# EasyEDA Pro project 小智扩展板.epro

# Board MP3语音模块
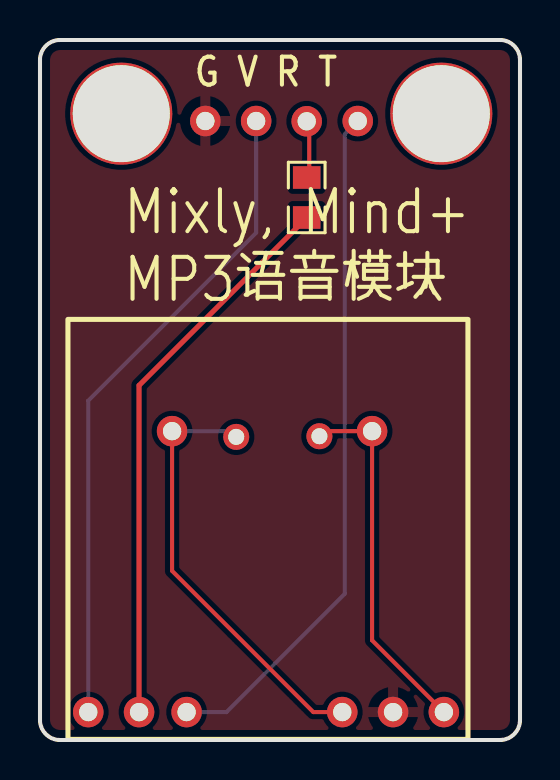
[diagram p0: board, top side]
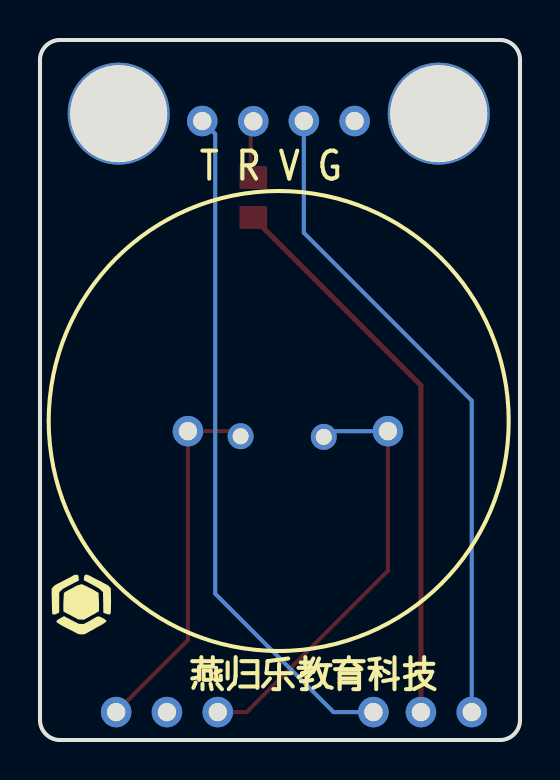
[diagram p1: board, bottom side, seen from below]

Outline 24 x 35 mm; copper layers: Top Layer, Bottom Layer. Coordinates in mm from the lower left corner of the outline.
Outline path: 0,34 0,1 arc(0.29,0.29) 1,0 23,0 arc(23.71,0.29) 24,1 24,34 arc(23.71,34.71) 23,35 1,35 arc(0.29,34.71) 0,34
Stack: Top Layer 0.0356mm / Dielectric1 0.32mm FR-4 er 4.8 / Bottom Layer 0.0356mm

## Design rules (mm)
template: 用户自定义配置
spacing Clearance (default): track to track 0.254, other pairs 0 to 0.254
track width Width (default): min 0.203, default 0.254, max 0.762
differential pair DiffPairsRouting (default): width min 0.381, default 0.381, max 0.381; gap min 0.254, default 0.254
via RoutingVias (default): diameter min 1.27, default 1.27, max 1.27; hole min 0.711, default 0.711, max 0.711

## Placement (name value [footprint] x y rotation side)
NOREF  -  [Pad_e131]  16.6 15.44 180 top
NOREF#2  -  [Pad_ie20]  15.11 1.4 0 top
NOREF#3  -  [Pad_ie118]  9.81 15.16 180 top
NOREF#4  -  [Pad_e315]  20.07 31.32 180 top
NOREF#5  -  [Pad_ie58]  10.81 30.95 180 top
NOREF#6  -  [Pad_ie83]  8.27 30.95 180 top
NOREF#7  -  [Pad_ie56]  13.34 30.94 180 top
NOREF#8  -  [Pad_e312]  4.06 31.32 180 top
NOREF#9  -  [Pad_e130]  6.6 15.44 180 top
NOREF#10  -  [Pad_ie12]  2.41 1.4 0 top
NOREF#11  -  [Pad_ie117]  13.97 15.19 180 top
NOREF#12  -  [Pad_ie15]  4.95 1.4 0 top
NOREF#13  -  [Pad_ie35]  15.89 30.95 180 top
NOREF#14  -  [Pad_ie25]  17.65 1.4 0 top
NOREF#15  -  [Pad_ie26]  20.19 1.4 0 top
NOREF#16  -  [Pad_ie2]  7.33 1.4 0 top
R1  1kΩ  [R0805]  13.34 27.13 90 top

## Footprints (pads in the part's own frame, mm; a bottom-side part is the same pattern mirrored in y, then rotated)
Pad_e130
  round 1.524 hole 0.914: 1(0,0)
Pad_e131
  round 1.524 hole 0.914: 2(0,0)
Pad_e312
  round 5.1 hole 4.85: 3(0,0)
Pad_e315
  round 5.1 hole 4.85: 3(0,0)
Pad_ie2
  round 1.524 hole 0.914: 12(0,0)
Pad_ie12
  round 1.524 hole 0.914: 12(0,0)
Pad_ie15
  round 1.524 hole 0.914: 12(0,0)
Pad_ie20
  round 1.524 hole 0.914: 12(0,0)
Pad_ie25
  round 1.524 hole 0.914: 11(0,0)
Pad_ie26
  round 1.524 hole 0.914: 11(0,0)
Pad_ie35
  round 1.524 hole 0.914: 12(0,0)
Pad_ie56
  round 1.524 hole 0.914: 12(0,0)
Pad_ie58
  round 1.524 hole 0.914: 12(0,0)
Pad_ie83
  round 1.524 hole 0.914: 12(0,0)
Pad_ie117
  round 1.3 hole 0.8: 1(0,0)
Pad_ie118
  round 1.3 hole 0.8: 1(0,0)
R0805
  rect 1.133x1.377 smd: 1(-1,0) 2(1,0)

## Nets
GND: NOREF#6.12 NOREF#14.11
VCC: NOREF#5.12 NOREF#10.12
RX1: NOREF#12.12 R1.1
RX2: NOREF#7.12 R1.2
SPK1: NOREF#2.12 NOREF#3.1 NOREF#9.1
SPK2: NOREF.2 NOREF#11.1 NOREF#15.11
TX1: NOREF#13.12 NOREF#16.12

Pads without a net: NOREF#4 3; NOREF#8 3

## Routing (per net, layer and track width the routed paths; a pad name or vN(x,y) marks a point on that pad's centre or on a via; arc(x,y) is an arc through that point)
VCC: length 33
  Top Layer w0.203: NOREF#5.12 10.8,30.96
  Bottom Layer w0.203: NOREF#5.12 10.81,25.36 2.41,16.97 NOREF#10.12
RX1: length 28.1
  Top Layer w0.254: NOREF#12.12 4.95,17.73 13.21,25.98 13.21,26.13
RX2: length 3
  Top Layer w0.203: NOREF#7.12 13.46,30.81 13.46,28.02
SPK1: length 21.7
  Top Layer w0.203: NOREF#9.1 6.6,8.46 13.66,1.4 NOREF#2.12
  Bottom Layer w0.203: NOREF#9.1 9.53,15.44 NOREF#3.1
SPK2: length 18.2
  Top Layer w0.203: 14.06,15.09 14.41,15.44 NOREF.2 16.6,4.98 NOREF#15.11
TX1: length 34.3
  Bottom Layer w0.203: NOREF#16.12 9.32,1.4 15.24,7.31 15.24,30.3 NOREF#13.12

## Copper pours and planes (outline as drawn; the poured copper is in the pictures)
GND on Top Layer: -0.76,35.64 24.51,35.64 24.51,-0.69 -0.76,-0.69

Small or netless copper shapes (teardrops, artwork), in the pictures only: 1 on Bottom Layer

## Text on the board
Bottom Silkscreen Layer: T R V G | 燕归乐教育科技
Top Silkscreen Layer: G V R T | Mixly, Mind+ / MP3语音模块
